# EAGLE schematic main (EAGLE 6.5.0)
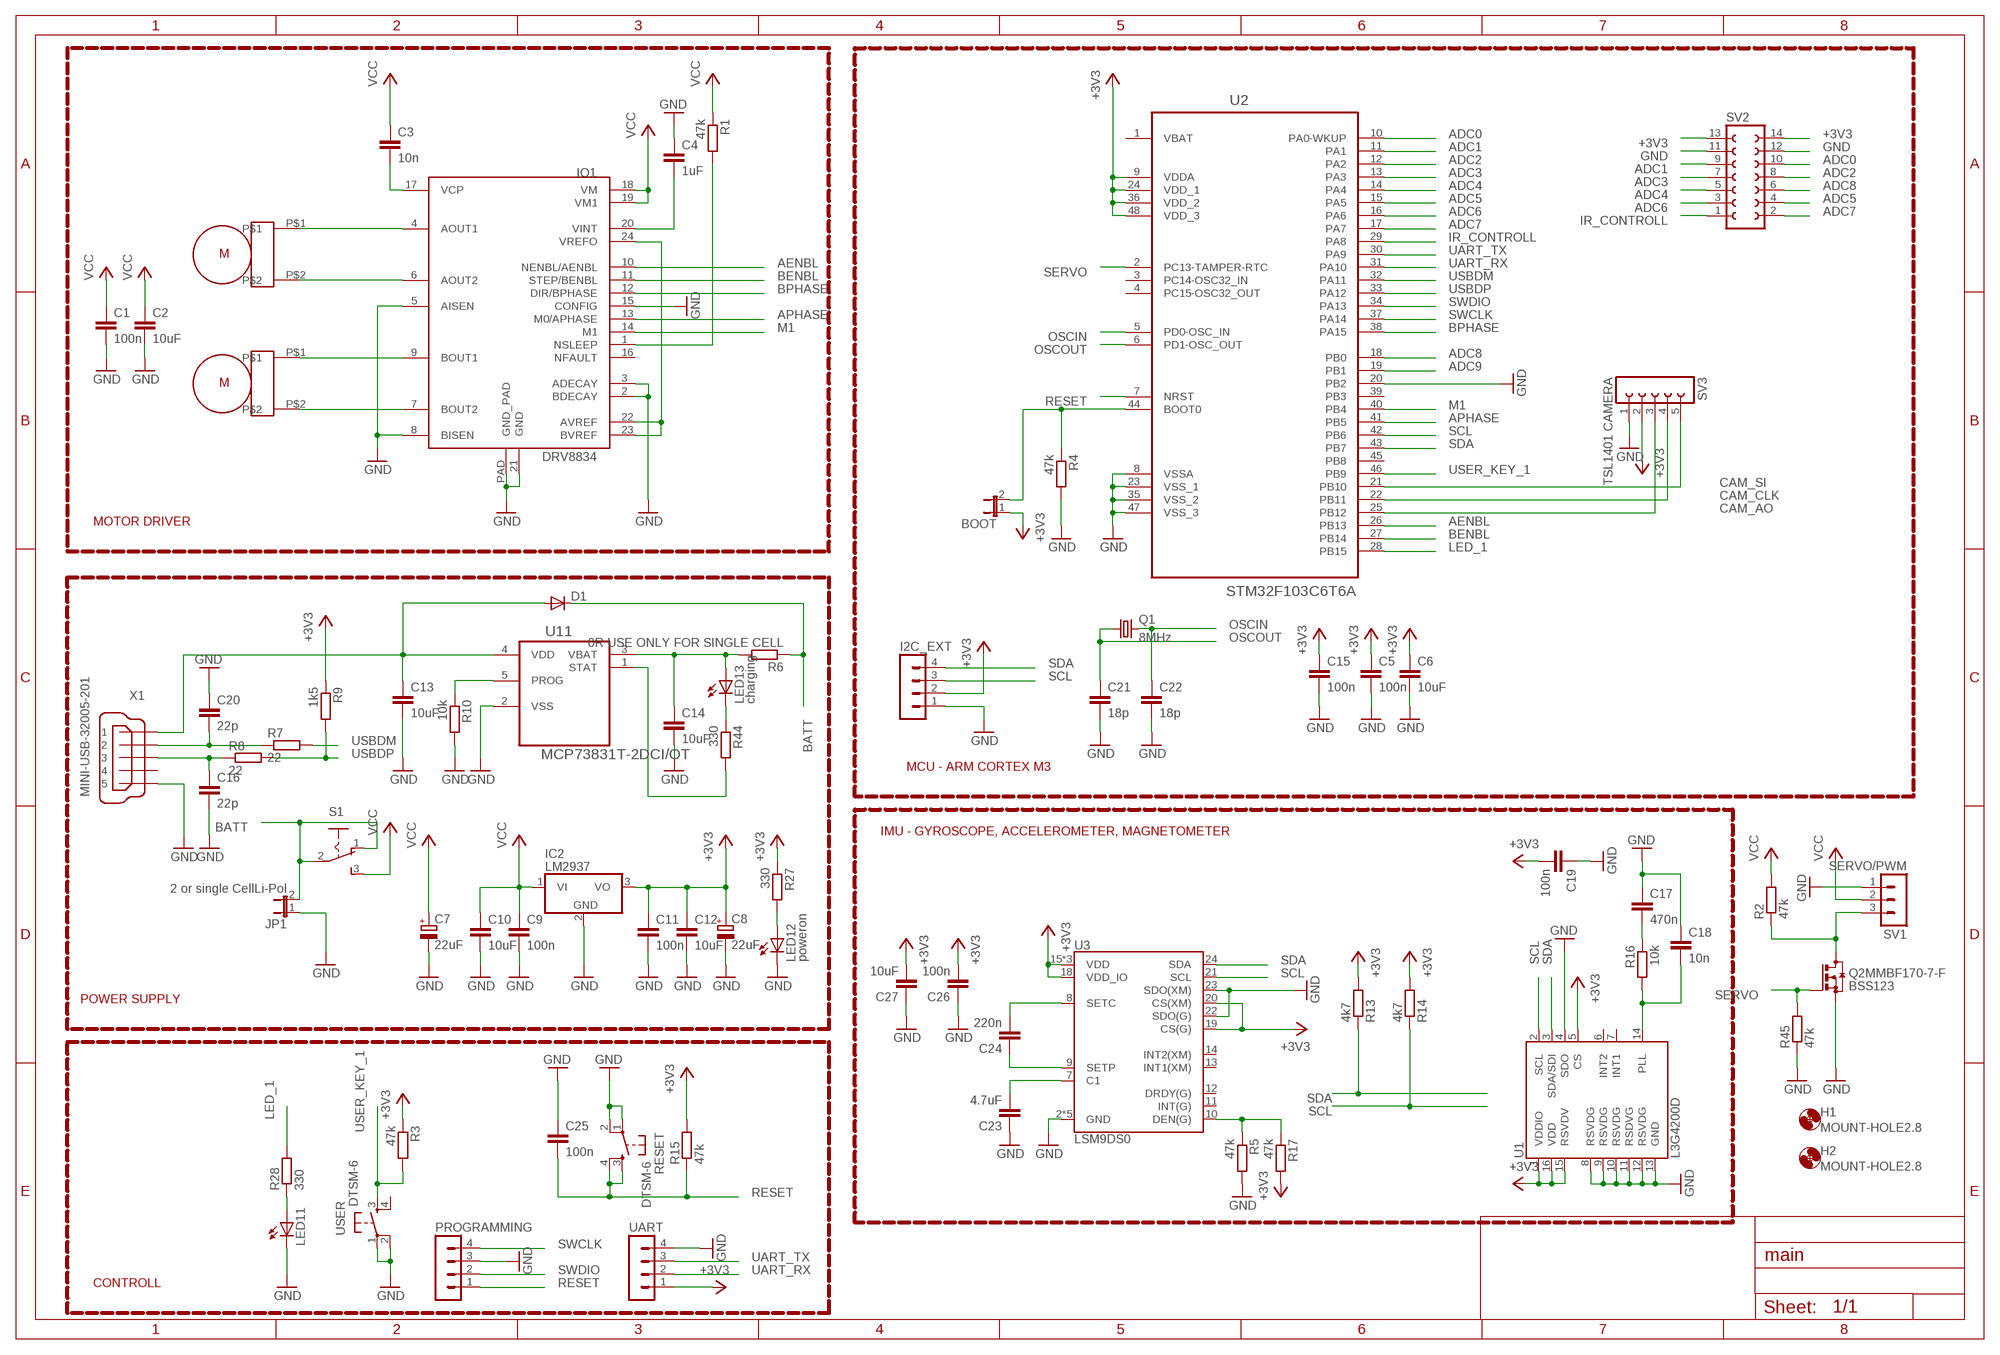
[diagram p0: schematic, sheet 1, part 1 of 2]
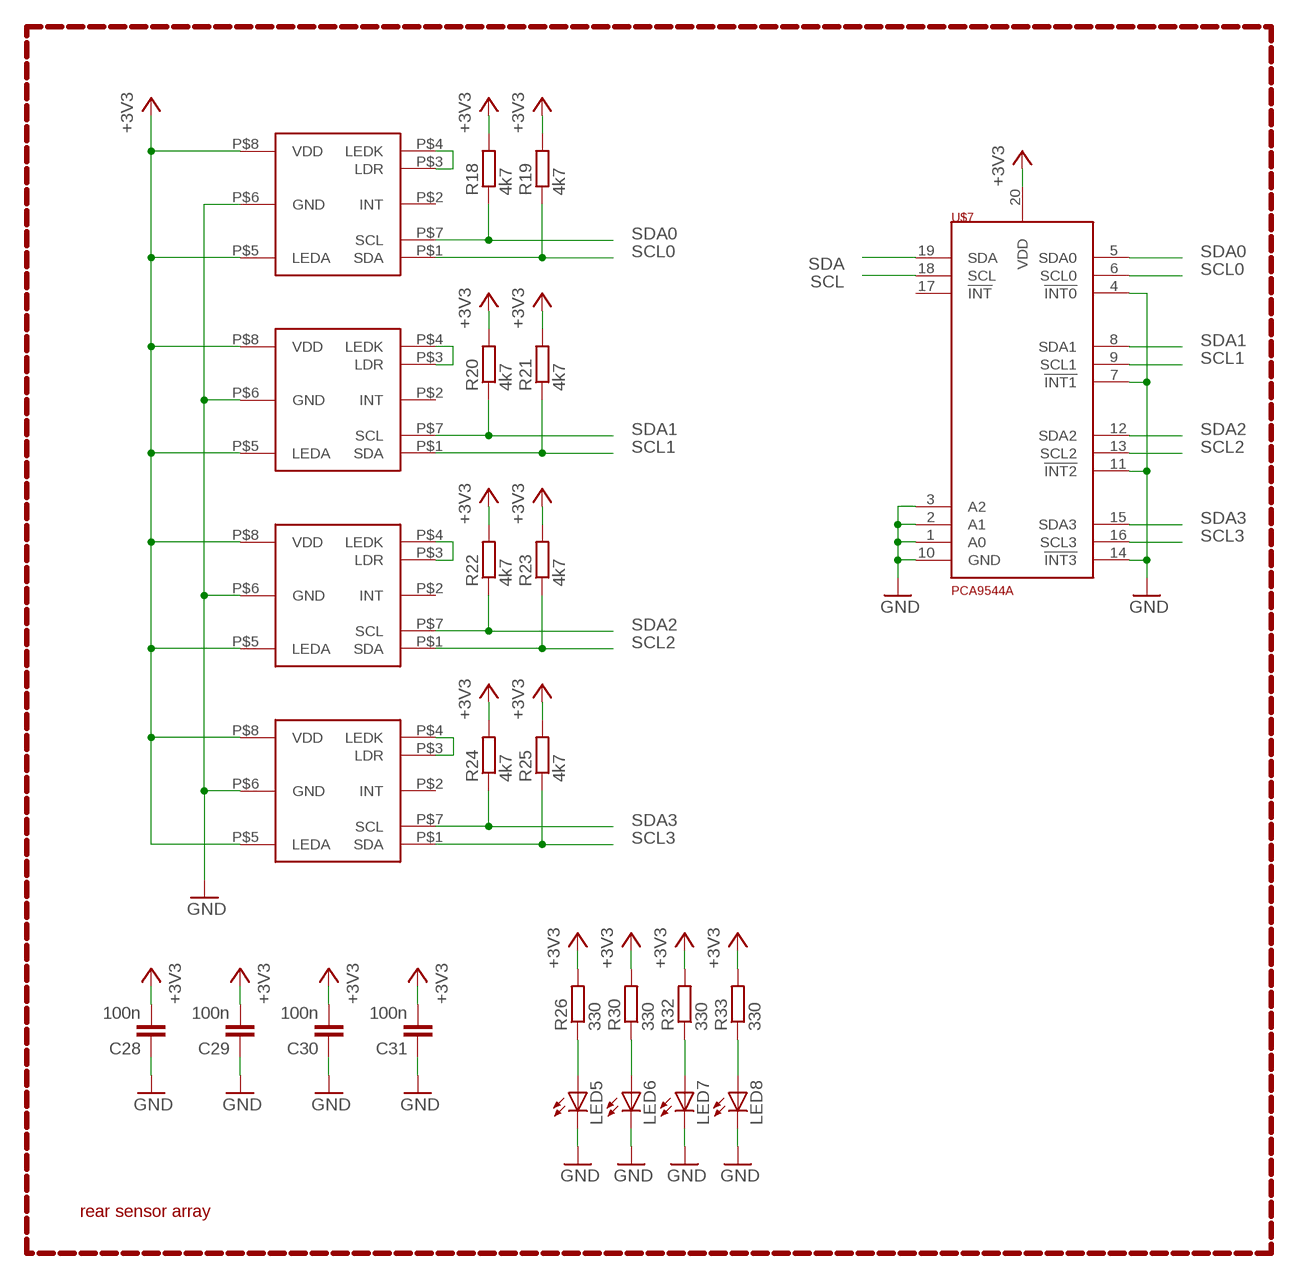
[diagram p1: schematic, sheet 1, part 2 of 2]

## Parts
BOOT  JP1E  [JP1]
C1  100n  C-EUC1206  [C1206]
C2  10uF  C-EUC1206  [C1206]
C3  10n  C-EUC1206  [C1206]
C4  1uF  C-EUC1206  [C1206]
C5  100n  C-EUC0805  [C0805]
C6  10uF  C-EUC0805  [C0805]
C7  22uF  CPOL-EU153CLV-0505  [153CLV-0505]
C8  22uF  CPOL-EU153CLV-0505  [153CLV-0505]
C9  100n  C-EUC0805  [C0805]
C10  10uF  C-EUC0805  [C0805]
C11  100n  C-EUC0805  [C0805]
C12  10uF  C-EUC0805  [C0805]
C13  10uF  C-EUC0805  [C0805]
C14  10uF  C-EUC0805  [C0805]
C15  100n  C-EUC0805  [C0805]
C16  22p  C-EUC0805  [C0805]
C17  470n  C-EUC0805  [C0805]
C18  10n  C-EUC0805  [C0805]
C19  100n  C-EUC0805  [C0805]
C20  22p  C-EUC0805  [C0805]
C21  18p  C-EUC0805  [C0805]
C22  18p  C-EUC0805  [C0805]
C23  4.7uF  C-EUC0805  [C0805]
C24  220n  C-EUC0805  [C0805]
C25  100n  C-EUC0805  [C0805]
C26  100n  C-EUC0805  [C0805]
C27  10uF  C-EUC0805  [C0805]
C28  100n  C-EUC0805  [C0805]
C29  100n  C-EUC0805  [C0805]
C30  100n  C-EUC0805  [C0805]
C31  100n  C-EUC0805  [C0805]
D1  DIODE-SMB  [SMB]
H1  MOUNT-HOLE2.8  [2,8]
H2  MOUNT-HOLE2.8  [2,8]
I2C_EXT  MA04-1  [MA04-1]
IC2  LM2937  [TO263-3]
IO1  DRV8834  [DRV8834_PCK]
JP1  2 or single CellLi-Pol  JP1E  [JP1]
LED5  LEDCHIPLED_1206  [CHIPLED_1206]
LED6  LEDCHIPLED_1206  [CHIPLED_1206]
LED7  LEDCHIPLED_1206  [CHIPLED_1206]
LED8  LEDCHIPLED_1206  [CHIPLED_1206]
LED11  LEDCHIPLED_1206  [CHIPLED_1206]
LED12  poweron  LEDCHIPLED_1206  [CHIPLED_1206]
LED13  charging  LEDCHIPLED_1206  [CHIPLED_1206]
PROGRAMMING  MA04-1  [MA04-1]
Q1  8MHz  CRYSTALCTS406  [CTS406]
Q2MMBF170-7-F  BSS123  [SOT23]
R1  47k  R-EU_M1206  [M1206]
R2  47k  R-EU_M0805  [M0805]
R3  47k  R-EU_M0805  [M0805]
R4  47k  R-EU_M0805  [M0805]
R5  47k  R-EU_M0805  [M0805]
R6  0R USE ONLY FOR SINGLE CELL  R-EU_M1206  [M1206]
R7  22  R-EU_M0805  [M0805]
R8  22  R-EU_M0805  [M0805]
R9  1k5  R-EU_M0805  [M0805]
R10  10k  R-EU_M0805  [M0805]
R13  4k7  R-EU_M0805  [M0805]
R14  4k7  R-EU_M0805  [M0805]
R15  47k  R-EU_M0805  [M0805]
R16  10k  R-EU_M0805  [M0805]
R17  47k  R-EU_M0805  [M0805]
R18  4k7  R-EU_M0805  [M0805]
R19  4k7  R-EU_M0805  [M0805]
R20  4k7  R-EU_M0805  [M0805]
R21  4k7  R-EU_M0805  [M0805]
R22  4k7  R-EU_M0805  [M0805]
R23  4k7  R-EU_M0805  [M0805]
R24  4k7  R-EU_M0805  [M0805]
R25  4k7  R-EU_M0805  [M0805]
R26  330  R-EU_M0805  [M0805]
R27  330  R-EU_M0805  [M0805]
R28  330  R-EU_M0805  [M0805]
R30  330  R-EU_M0805  [M0805]
R32  330  R-EU_M0805  [M0805]
R33  330  R-EU_M0805  [M0805]
R44  330  R-EU_M0805  [M0805]
R45  47k  R-EU_M0805  [M0805]
RESET  DTSM-6  [DTSM-6]
S1  255SB  [255SB]
SV1  SERVO/PWM  MA03-1  [MA03-1]
SV2  FE07-2  [FE07-2]
SV3  TSL1401 CAMERA  FE05-1  [FE05-1]
U1  L3G4200D  [LGA16-4X4]
U2  STM32F103C6T6A  [QFP50P900X900X160-48N]
U3  LSM9DS0  [LGA-24]
U11  MCP73831T-2DCI/OT  [SOT95P270X145-5N]
U$1  MICRO_METAL_GEAR_MOTOR  [MICRO_METAL_GEAR_MOTOR]
U$2  MICRO_METAL_GEAR_MOTOR  [MICRO_METAL_GEAR_MOTOR]
U$3  APDS9950  [APDS9950]
U$4  APDS9950  [APDS9950]
U$5  APDS9950  [APDS9950]
U$6  APDS9950  [APDS9950]
U$7  DSSCIRCUITS_PCA9544A  [DSSCIRCUITS_TSSOP20]
UART  MA04-1  [MA04-1]
USER  DTSM-6  [DTSM-6]
X1  MINI-USB-32005-201  [32005-201]

## Nets
+3V3: BOOT.1 C5.1 C6.1 C8.+ C11.1 C12.1 C15.1 C19.2 C26.2 C27.2 C28.2 C29.2 C30.2 C31.2 I2C_EXT.2 IC2.3(VO) R3.1 R9.1 R13.2 R14.2 R15.2 R17.2 R18.2 R19.2 R20.2 R21.2 R22.2 R23.2 R24.2 R25.2 R26.2 R27.1 R30.2 R32.2 R33.2 SV2.13 SV2.14 SV3.2 U1.1(VDDIO) U1.5(CS) U1.15(RSVDV) U1.16(VDD) U2.9(VDDA) U2.24(VDD_1) U2.36(VDD_2) U2.48(VDD_3) U3.15(VDD) U3.16(VDD) U3.17(VDD) U3.18(VDD_IO) U3.19(CS(G)) U3.20(CS(XM)) U$3.P$5(LEDA) U$3.P$8(VDD) U$4.P$5(LEDA) U$4.P$8(VDD) U$5.P$5(LEDA) U$5.P$8(VDD) U$6.P$5(LEDA) U$6.P$8(VDD) U$7.20(VDD) UART.1
ADC0: SV2.10 U2.10(PA0-WKUP)
ADC1: SV2.9 U2.11(PA1)
ADC2: SV2.8 U2.12(PA2)
ADC3: SV2.7 U2.13(PA3)
ADC4: SV2.5 U2.14(PA4)
ADC5: SV2.4 U2.15(PA5)
ADC6: SV2.3 U2.16(PA6)
ADC7: SV2.2 U2.17(PA7)
ADC8: SV2.6 U2.18(PB0)
ADC9: U2.19(PB1)
AENBL: IO1.10(NENBL/AENBL) U2.26(PB13)
APHASE: IO1.13(M0/APHASE) U2.41(PB5)
BATT: D1.C JP1.2 R6.1 S1.1(O) S1.2(P)
BENBL: IO1.11(STEP/BENBL) U2.27(PB14)
BPHASE: IO1.12(DIR/BPHASE) U2.38(PA15)
CAM_AO: SV3.3 U2.25(PB12)
CAM_CLK: SV3.4 U2.22(PB11)
CAM_SI: SV3.5 U2.21(PB10)
GND: C1.2 C2.2 C4.1 C5.2 C6.2 C7.- C8.- C9.2 C10.2 C11.2 C12.2 C13.2 C14.2 C15.2 C16.2 C17.1 C18.1 C19.1 C20.1 C21.2 C22.2 C23.1 C25.1 C26.1 C27.1 C28.1 C29.1 C30.1 C31.1 I2C_EXT.1 IC2.2(GND) IO1.2(BDECAY) IO1.3(ADECAY) IO1.5(AISEN) IO1.8(BISEN) IO1.15(CONFIG) IO1.21(GND) IO1.PAD(GND_PAD) JP1.1 LED5.C LED6.C LED7.C LED8.C LED11.C LED12.C PROGRAMMING.3 Q2MMBF170-7-F.2(S) R4.2 R5.2 R10.2 R45.1 RESET.1 RESET.2 SV1.1 SV2.11 SV2.12 SV3.1 U1.4(SDO) U1.8(RSVDG) U1.9(RSVDG) U1.10(RSVDG) U1.11(RSDVG) U1.12(RSVDG) U1.13(GND) U2.8(VSSA) U2.20(PB2) U2.23(VSS_1) U2.35(VSS_2) U2.47(VSS_3) U3.2(GND) U3.3(GND) U3.4(GND) U3.5(GND) U3.6(GND) U3.22(SDO(G)) U3.23(SDO(XM)) U11.2(VSS) U$3.P$6(GND) U$4.P$6(GND) U$5.P$6(GND) U$6.P$6(GND) U$7.1(A0) U$7.2(A1) U$7.3(A2) U$7.4(!INT0) U$7.7(!INT1) U$7.10(GND) U$7.11(!INT2) U$7.14(!INT3) UART.4 USER.1 USER.2 X1.5
IR_CONTROLL: SV2.1 U2.29(PA8)
LED_1: R28.2 U2.28(PB15)
M1: IO1.14(M1) U2.40(PB4)
N$1: IO1.4(AOUT1) U$1.P$1
N$2: IO1.6(AOUT2) U$1.P$2
N$3: IO1.9(BOUT1) U$2.P$1
N$4: IO1.7(BOUT2) U$2.P$2
N$5: C3.2 IO1.17(VCP)
N$6: C23.2 U3.7(C1)
N$7: C24.2 U3.8(SETC)
N$8: IO1.22(AVREF) IO1.23(BVREF) IO1.24(VREFO)
N$9: IO1.1(NSLEEP) R1.2
N$13: C24.1 U3.9(SETP)
N$16: BOOT.2 R4.1 U2.44(BOOT0)
N$17: R44.2 U11.1(STAT)
N$18: R5.1 R17.1 U3.10(DEN(G))
N$19: C18.2 R16.2 U1.14(PLL)
N$20: C17.2 R16.1
N$21: U$6.P$3(LDR) U$6.P$4(LEDK)
N$22: C4.2 IO1.20(VINT)
N$23: LED12.A R27.2
N$24: LED13.C R44.1
N$25: U$5.P$3(LDR) U$5.P$4(LEDK)
N$26: Q2MMBF170-7-F.3(D) R2.1 SV1.3
N$27: U$4.P$3(LDR) U$4.P$4(LEDK)
N$28: U$3.P$3(LDR) U$3.P$4(LEDK)
N$33: LED11.A R28.1
N$38: LED5.A R26.1
N$39: LED6.A R30.1
N$40: LED7.A R32.1
N$41: LED8.A R33.1
N$53: C14.1 LED13.A R6.2 U11.3(VBAT)
N$54: R10.1 U11.5(PROG)
N$55: C20.2 R7.1 X1.2
N$56: C16.1 R8.1 X1.3
N$57: C13.1 D1.A U11.4(VDD) X1.1
OSCIN: C22.1 Q1.3 U2.5(PD0-OSC_IN)
OSCOUT: C21.1 Q1.1 U2.6(PD1-OSC_OUT)
RESET: C25.2 PROGRAMMING.1 R15.1 RESET.3 RESET.4 U2.7(NRST)
SCL: I2C_EXT.3 R14.1 U1.2(SCL) U2.42(PB6) U3.21(SCL) U$7.18(SCL)
SCL0: R19.1 U$3.P$1(SDA) U$7.6(SCL0)
SCL1: R21.1 U$4.P$1(SDA) U$7.9(SCL1)
SCL2: R23.1 U$5.P$1(SDA) U$7.13(SCL2)
SCL3: R25.1 U$6.P$1(SDA) U$7.16(SCL3)
SDA: I2C_EXT.4 R13.1 U1.3(SDA/SDI) U2.43(PB7) U3.24(SDA) U$7.19(SDA)
SDA0: R18.1 U$3.P$7(SCL) U$7.5(SDA0)
SDA1: R20.1 U$4.P$7(SCL) U$7.8(SDA1)
SDA2: R22.1 U$5.P$7(SCL) U$7.12(SDA2)
SDA3: R24.1 U$6.P$7(SCL) U$7.15(SDA3)
SERVO: Q2MMBF170-7-F.1(G) R45.2 U2.2(PC13-TAMPER-RTC)
SWCLK: PROGRAMMING.4 U2.37(PA14)
SWDIO: PROGRAMMING.2 U2.34(PA13)
UART_RX: U2.31(PA10) UART.2
UART_TX: U2.30(PA9) UART.3
USBDM: R7.2 U2.32(PA11)
USBDP: R8.2 R9.2 U2.33(PA12)
USER_KEY_1: R3.2 U2.46(PB9) USER.3
VCC: C1.1 C2.1 C3.1 C7.+ C9.1 C10.1 IC2.1(VI) IO1.18(VM) IO1.19(VM1) R1.1 R2.2 S1.3(S) SV1.2
Unconnected: IO1.16(NFAULT) U1.6(INT2) U1.7(INT1) U2.3(PC14-OSC32_IN) U2.4(PC15-OSC32_OUT) U2.39(PB3) U2.45(PB8) U3.11(INT(G)) U3.12(DRDY(G)) U3.13(INT1(XM)) U3.14(INT2(XM)) U$3.P$2(INT) U$4.P$2(INT) U$5.P$2(INT) U$6.P$2(INT) U$7.17(!INT) USER.4 X1.4

## Notes on the sheet
- MOTOR DRIVER
- MCU - ARM CORTEX M3
- IMU - GYROSCOPE, ACCELEROMETER, MAGNETOMETER
- rear sensor array
- POWER SUPPLY
- CONTROLL

## Power pins joined to a net without a drawn wire
VBAT: U2.1(VBAT)

## Library data of the parts
BOOT JP1 = jumper:JP1E: JUMPER
C1-C6 C9-C31 = resistor:C-EU: CAPACITOR, European symbol
C7 C8 = resistor:CPOL-EU: POLARIZED CAPACITOR, European symbol
D1 = diode:DIODE-: DIODE
H1 H2 = holes:MOUNT-HOLE: MOUNTING HOLE with drill center marker
I2C_EXT PROGRAMMING UART = con-lstb:MA04-1: PIN HEADER; OC_FARNELL: unknown; OC_NEWARK: unknown
IC2 = linear:LM2937: LM2937-2.5, LM2937-3.3 400mA and 500mA Voltage Regulators Source: http://cache.national.com/ds/LM/LM2937-2.5.pdf
IO1 = yellow_car:DRV8834
LED5-LED8 LED11-LED13 = led:LED: LED OSRAM: - CHIPLED LG R971, LG N971, LY N971, LG Q971, LY Q971, LO R971, LY R971 LH N974, LH R974 LS Q976, LO Q976, LY Q976 LO Q996 - Hyper CHIPLED LW Q18S LB Q993, LB Q99A, LB R99A - SideLED LS A670, LO A670, LY A670, LG A670, LP A670 LB A673, LV A673, LT A673, LW A673 LH A674 LY A675 LS A676, LA A676, LO A676, LY A676, LW A676 LS A679, LY A679, LG A679 - Hyper Micro SIDELED® LS Y876, LA Y876, LO Y876, LY Y876 LT Y87S - SmartLED LW L88C, LW L88S LB L89C, LB L89S, LG L890 LS L89K, LO L89K, LY L89K LS L896, LA L896, LO L896, LY L896 - TOPLED LS T670, LO T670, LY T670, LG T670, LP T670 LSG T670, LSP T670, LSY T670, LOP T670, LYG T670 LG T671, LOG T671, LSG T671 LB T673, LV T673, LT T673, LW T673 LH T674 LS T676, LA T676, LO T676, LY T676, LB T676, LH T676, LSB T676, LW T676 LB T67C, LV T67C, LT T67C, LS T67K, LO T67K, LY T67K, LW E67C LS E67B, LA E67B, LO E67B, LY E67B, LB E67C, LV E67C, LT E67C LW T67C LS T679, LY T679, LG T679 LS T770, LO T770, LY T770, LG T770, LP T770 LB T773, LV T773, LT T773, LW T773 LH T774 LS E675, LA E675, LY E675, LS T675 LS T776, LA T776, LO T776, LY T776, LB T776 LHGB T686 LT T68C, LB T68C - Hyper Mini TOPLED® LB M676 - Mini TOPLED Santana® LG M470 LS M47K, LO M47K, LY M47K Source: http://www.osram.convergy.de LUXEON: - LUMILED® LXK2-PW12-R00, LXK2-PW12-S00, LXK2-PW14-U00, LXK2-PW14-V00 LXK2-PM12-R00, LXK2-PM12-S00, LXK2-PM14-U00 LXK2-PE12-Q00, LXK2-PE12-R00, LXK2-PE12-S00, LXK2-PE14-T00, LXK2-PE14-U00 LXK2-PB12-K00, LXK2-PB12-L00, LXK2-PB12-M00, LXK2-PB14-N00, LXK2-PB14-P00, LXK2-PB14-Q00 LXK2-PR12-L00, LXK2-PR12-M00, LXK2-PR14-Q00, LXK2-PR14-R00 LXK2-PD12-Q00, LXK2-PD12-R00, LXK2-PD12-S00 LXK2-PH12-R00, LXK2-PH12-S00 LXK2-PL12-P00, LXK2-PL12-Q00, LXK2-PL12-R00 Source: www.luxeon.com KINGBRIGHT: KA-3528ASYC Source: www.kingbright.com
Q1 = crystal:CRYSTAL: CRYSTAL; OC_FARNELL: unknown; OC_NEWARK: unknown
Q2MMBF170-7-F = transistor-small-signal:BSS123: N-CHANNEL MOS FET
R1-R10 R13-R28 R30 R32 R33 R44 R45 = resistor:R-EU_: RESISTOR, European symbol
RESET USER = switch-tact:DTSM-6
S1 = switch:255SB: SLIDING SWITCH Distributor Buerklin, 11G810
SV1 = con-lstb:MA03-1: PIN HEADER; OC_FARNELL: unknown; OC_NEWARK: unknown
SV2 = con-lsta:FE07-2: FEMALE HEADER; OC_FARNELL: unknown; OC_NEWARK: unknown
SV3 = con-lsta:FE05-1: FEMALE HEADER; OC_FARNELL: unknown; OC_NEWARK: unknown
U1 = my_parts:L3G4200D: L3G4200D Three-axis, digital output gyroscope The L3G4200D is a low-power three-axis angular rate sensor, has a full scale of ±250/±500/±2000 dps and is capable of measuring rates with a user-selectable bandwidth. It includes a sensing element and an IC interface capable of providing the measured angular rate to the external world through a digital interface (I2C/SPI). Package: 4x4x1.1 LGA-16 (LGA16-4x4.PAC)
U2 = stm32f103_lqfp48:STM32F103C6T6A: MCU, 32BIT, 32K FLASH, 48LQFP; MPN: STM32F103C6T6A; OC_FARNELL: 1972391; OC_NEWARK: 72T2643; PACKAGE: 48LQFP; SUPPLIER: STMicroelectronics
U3 = SparkFun-DigitalIC:LSM9DS0: LSM9DS0 3D Accelerometer, 3D Gyroscope, 3D Magnetomter Features: 3 acceleration channels, 3 angular rate channels, 3 magnetic field channels ±2/±4/±6/±8/±16 g linear acceleration full scale ±2/±4/±8/±12 gauss magnetic full scale ±245/±500/±2000 dps angular rate full scale 16-bit data output SPI / I2C serial interfaces Analog supply voltage 2.4 V to 3.6 V Power-down mode / low-power mode Programmable interrupt generators Embedded self-test Embedded temperature sensor Embedded FIFO Position and motion detection functions Click/double-click recognition
U11 = Microchip-MCP73831T-2DCI_OT:MCP73831T-2DCI/OT: Li-Polymer Charge Management Controllers, SOT23-5; MPN: MCP73831T-2DCI/OT; OC_FARNELL: 1840935; OC_NEWARK: 84R6271; PACKAGE: SOT23-5; SUPPLIER: Microchip
U$1 U$2 = pololu:MICRO_METAL_GEAR_MOTOR
U$3-U$6 = my_parts:APDS9950
U$7 = PCA9544A Breakout PCB:DSSCIRCUITS_PCA9544A
X1 = con-cypressindustries:MINI-USB-: MINI USB-B Conector Source: www.cypressindustries.com; OC_FARNELL: unknown; OC_NEWARK: unknown